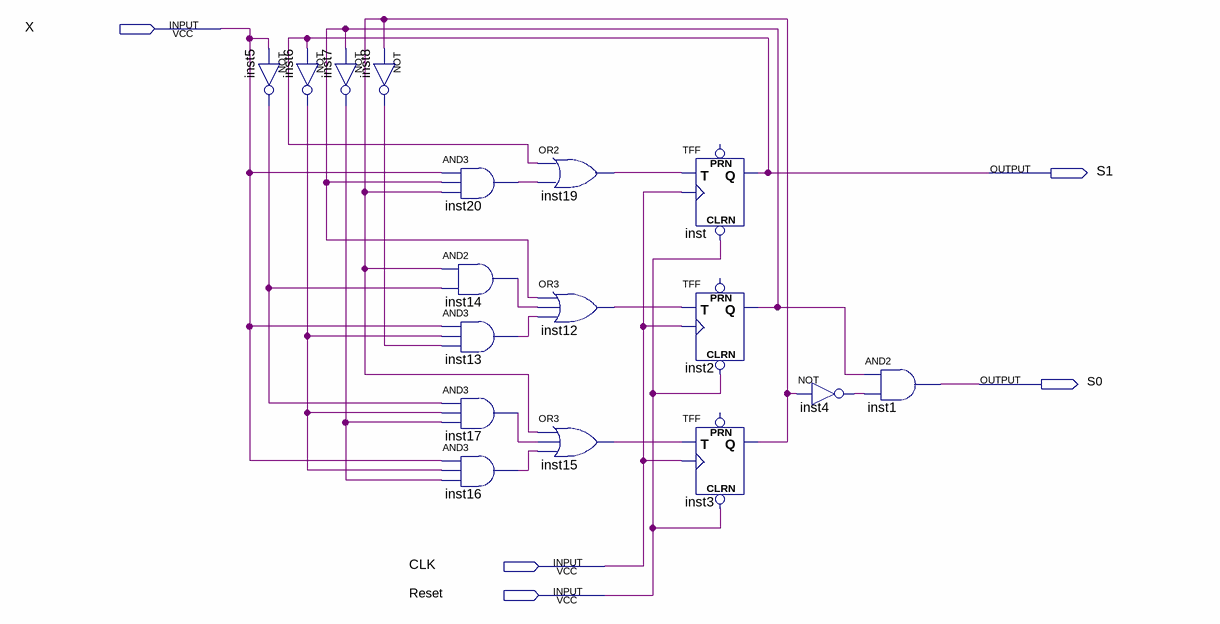
[diagram p0: schematic sheet]
// Quartus schematic Sequence_recogniser.bdf as structural Verilog: 17 symbols, 5 pins
module Sequence_recogniser (
  input  X,
  input  CLK,
  input  Reset,
  output S1,
  output S0
);

  wire inst2_q, inst3_q, inst4_out, inst5_out, inst6_out, inst7_out, inst8_out, inst12_out, inst13_out,
       inst14_out, inst15_out, inst16_out, inst17_out, inst19_out, inst20_out;

  not inst5 (inst5_out, X);
  not inst6 (inst6_out, S1);
  not inst7 (inst7_out, inst2_q);
  not inst8 (inst8_out, inst3_q);
  and inst20 (inst20_out, X, inst2_q, inst3_q);
  and inst14 (inst14_out, inst3_q, inst5_out);
  and inst13 (inst13_out, X, inst6_out, inst8_out);
  and inst17 (inst17_out, inst5_out, inst6_out, inst7_out);
  and inst16 (inst16_out, X, inst6_out, inst7_out);
  or inst19 (inst19_out, S1, inst20_out);
  or inst12 (inst12_out, inst2_q, inst14_out, inst13_out);
  or inst15 (inst15_out, inst3_q, inst17_out, inst16_out);
  TFF inst (.CLRN(Reset), .T(inst19_out), .CLK(CLK), .Q(S1));  // open: PRN
  TFF inst2 (.CLRN(Reset), .T(inst12_out), .CLK(CLK), .Q(inst2_q));  // open: PRN
  TFF inst3 (.CLRN(Reset), .T(inst15_out), .CLK(CLK), .Q(inst3_q));  // open: PRN
  not inst4 (inst4_out, inst3_q);
  and inst1 (S0, inst2_q, inst4_out);
endmodule
